# EAGLE design power_12v_5v_non_regulated (EAGLE 9.3.0)
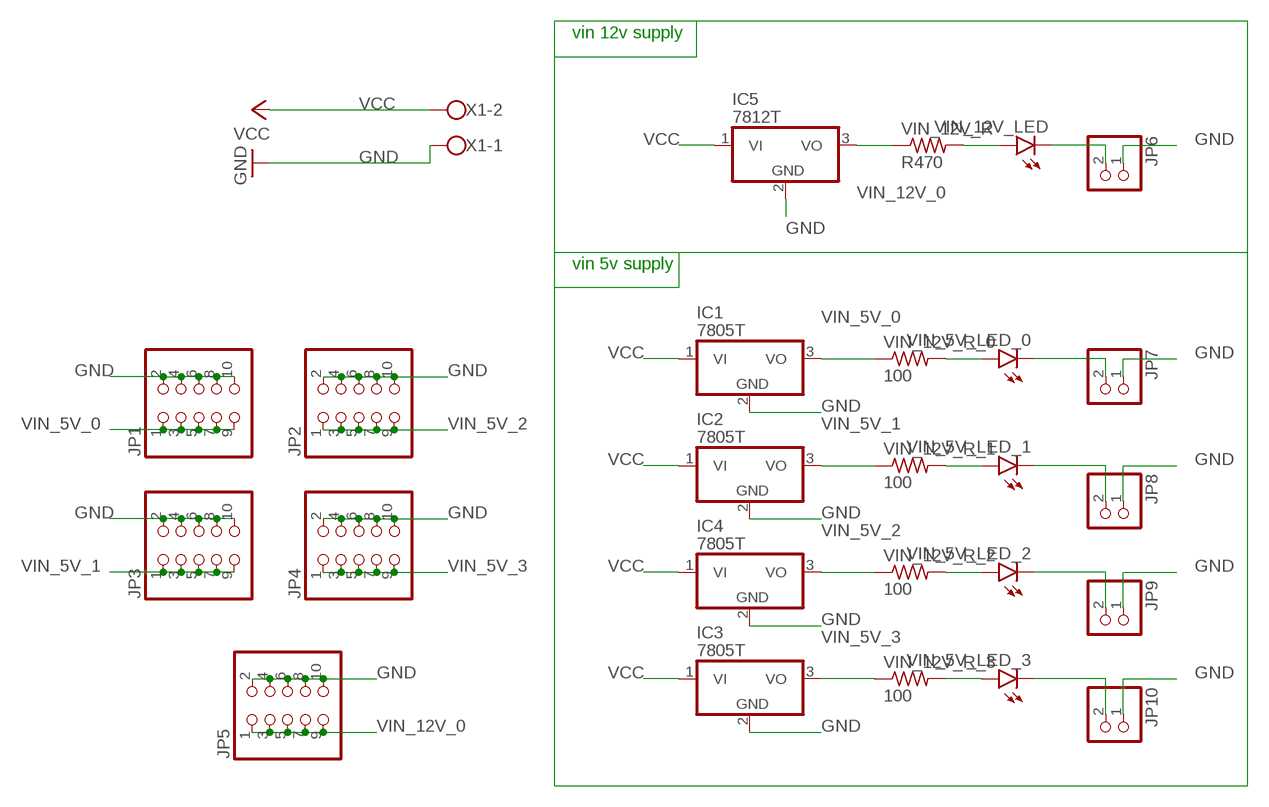
[diagram p0: schematic, sheet 1]

## Parts
IC1  7805T  [TO220H]
IC2  7805T  [TO220H]
IC3  7805T  [TO220H]
IC4  7805T  [TO220H]
IC5  7812T  [TO220H]
JP1  PINHD-2X5  [2X05]
JP2  PINHD-2X5  [2X05]
JP3  PINHD-2X5  [2X05]
JP4  PINHD-2X5  [2X05]
JP5  PINHD-2X5  [2X05]
JP6  PINHD-1X2  [1X02]
JP7  PINHD-1X2  [1X02]
JP8  PINHD-1X2  [1X02]
JP9  PINHD-1X2  [1X02]
JP10  PINHD-1X2  [1X02]
VIN_5V_LED_0  LEDSMT1206  [1206]
VIN_5V_LED_1  LEDSMT1206  [1206]
VIN_5V_LED_2  LEDSMT1206  [1206]
VIN_5V_LED_3  LEDSMT1206  [1206]
VIN_12V_LED  LEDSMT1206  [1206]
VIN_12V_R  R470  R-US_R0805  [R0805]
VIN_12V_R_0  100  R-US_R0805  [R0805]
VIN_12V_R_1  100  R-US_R0805  [R0805]
VIN_12V_R_2  100  R-US_R0805  [R0805]
VIN_12V_R_3  100  R-US_R0805  [R0805]
X1  W237-102  [W237-102]

## Nets
GND: IC1.2(GND) IC2.2(GND) IC3.2(GND) IC4.2(GND) IC5.2(GND) JP1.2 JP1.4 JP1.6 JP1.8 JP1.10 JP2.2 JP2.4 JP2.6 JP2.8 JP2.10 JP3.2 JP3.4 JP3.6 JP3.8 JP3.10 JP4.2 JP4.4 JP4.6 JP4.8 JP4.10 JP5.2 JP5.4 JP5.6 JP5.8 JP5.10 JP6.1 JP7.1 JP8.1 JP9.1 JP10.1 X1.1
N$2: VIN_12V_LED.A VIN_12V_R.2
N$4: VIN_5V_LED_0.A VIN_12V_R_0.2
N$6: VIN_5V_LED_1.A VIN_12V_R_1.2
N$8: VIN_5V_LED_2.A VIN_12V_R_2.2
N$10: VIN_5V_LED_3.A VIN_12V_R_3.2
N$19: JP7.2 VIN_5V_LED_0.C
N$20: JP6.2 VIN_12V_LED.C
N$21: JP8.2 VIN_5V_LED_1.C
N$22: JP9.2 VIN_5V_LED_2.C
N$23: JP10.2 VIN_5V_LED_3.C
VCC: IC1.1(VI) IC2.1(VI) IC3.1(VI) IC4.1(VI) IC5.1(VI) X1.2
VIN_5V_0: IC1.3(VO) JP1.1 JP1.3 JP1.5 JP1.7 JP1.9 VIN_12V_R_0.1
VIN_5V_1: IC2.3(VO) JP3.1 JP3.3 JP3.5 JP3.7 JP3.9 VIN_12V_R_1.1
VIN_5V_2: IC4.3(VO) JP2.1 JP2.3 JP2.5 JP2.7 JP2.9 VIN_12V_R_2.1
VIN_5V_3: IC3.3(VO) JP4.1 JP4.3 JP4.5 JP4.7 JP4.9 VIN_12V_R_3.1
VIN_12V_0: IC5.3(VO) JP5.1 JP5.3 JP5.5 JP5.7 JP5.9 VIN_12V_R.1

## Notes on the sheet
- vin 12v supply
- vin 5v supply

## Library data of the parts
IC1-IC5 = linear:78*: Positive VOLTAGE REGULATOR Source: http://cache.national.com/ds/LM/LM78L05.pdf http://www.fairchildsemi.com/ds/LM/LM7805.pdf
JP1-JP5 = pinhead:PINHD-2X5: PIN HEADER
JP6-JP10 = pinhead:PINHD-1X2: PIN HEADER
VIN_5V_LED_0 VIN_5V_LED_1-VIN_5V_LED_3 VIN_12V_LED = led:LED: LED OSRAM: - CHIPLED LG R971, LG N971, LY N971, LG Q971, LY Q971, LO R971, LY R971 LH N974, LH R974 LS Q976, LO Q976, LY Q976 LO Q996 - Hyper CHIPLED LW Q18S LB Q993, LB Q99A, LB R99A - SideLED LS A670, LO A670, LY A670, LG A670, LP A670 LB A673, LV A673, LT A673, LW A673 LH A674 LY A675 LS A676, LA A676, LO A676, LY A676, LW A676 LS A679, LY A679, LG A679 - Hyper Micro SIDELED® LS Y876, LA Y876, LO Y876, LY Y876 LT Y87S - SmartLED LW L88C, LW L88S LB L89C, LB L89S, LG L890 LS L89K, LO L89K, LY L89K LS L896, LA L896, LO L896, LY L896 - TOPLED LS T670, LO T670, LY T670, LG T670, LP T670 LSG T670, LSP T670, LSY T670, LOP T670, LYG T670 LG T671, LOG T671, LSG T671 LB T673, LV T673, LT T673, LW T673 LH T674 LS T676, LA T676, LO T676, LY T676, LB T676, LH T676, LSB T676, LW T676 LB T67C, LV T67C, LT T67C, LS T67K, LO T67K, LY T67K, LW E67C LS E67B, LA E67B, LO E67B, LY E67B, LB E67C, LV E67C, LT E67C LW T67C LS T679, LY T679, LG T679 LS T770, LO T770, LY T770, LG T770, LP T770 LB T773, LV T773, LT T773, LW T773 LH T774 LS E675, LA E675, LY E675, LS T675 LS T776, LA T776, LO T776, LY T776, LB T776 LHGB T686 LT T68C, LB T68C - Hyper Mini TOPLED® LB M676 - Mini TOPLED Santana® LG M470 LS M47K, LO M47K, LY M47K Source: http://www.osram.convergy.de LUXEON: - LUMILED® LXK2-PW12-R00, LXK2-PW12-S00, LXK2-PW14-U00, LXK2-PW14-V00 LXK2-PM12-R00, LXK2-PM12-S00, LXK2-PM14-U00 LXK2-PE12-Q00, LXK2-PE12-R00, LXK2-PE12-S00, LXK2-PE14-T00, LXK2-PE14-U00 LXK2-PB12-K00, LXK2-PB12-L00, LXK2-PB12-M00, LXK2-PB14-N00, LXK2-PB14-P00, LXK2-PB14-Q00 LXK2-PR12-L00, LXK2-PR12-M00, LXK2-PR14-Q00, LXK2-PR14-R00 LXK2-PD12-Q00, LXK2-PD12-R00, LXK2-PD12-S00 LXK2-PH12-R00, LXK2-PH12-S00 LXK2-PL12-P00, LXK2-PL12-Q00, LXK2-PL12-R00 Source: www.luxeon.com KINGBRIGHT: KA-3528ASYC Source: www.kingbright.com
VIN_12V_R VIN_12V_R_0 VIN_12V_R_1-VIN_12V_R_3 = rcl:R-US_: RESISTOR, American symbol; SPICEPREFIX: R
X1 = con-wago-500:W237-102: WAGO SCREW CLAMP; MPN: 237-102; OC_FARNELL: unknown; OC_NEWARK: 70K9898

## Board
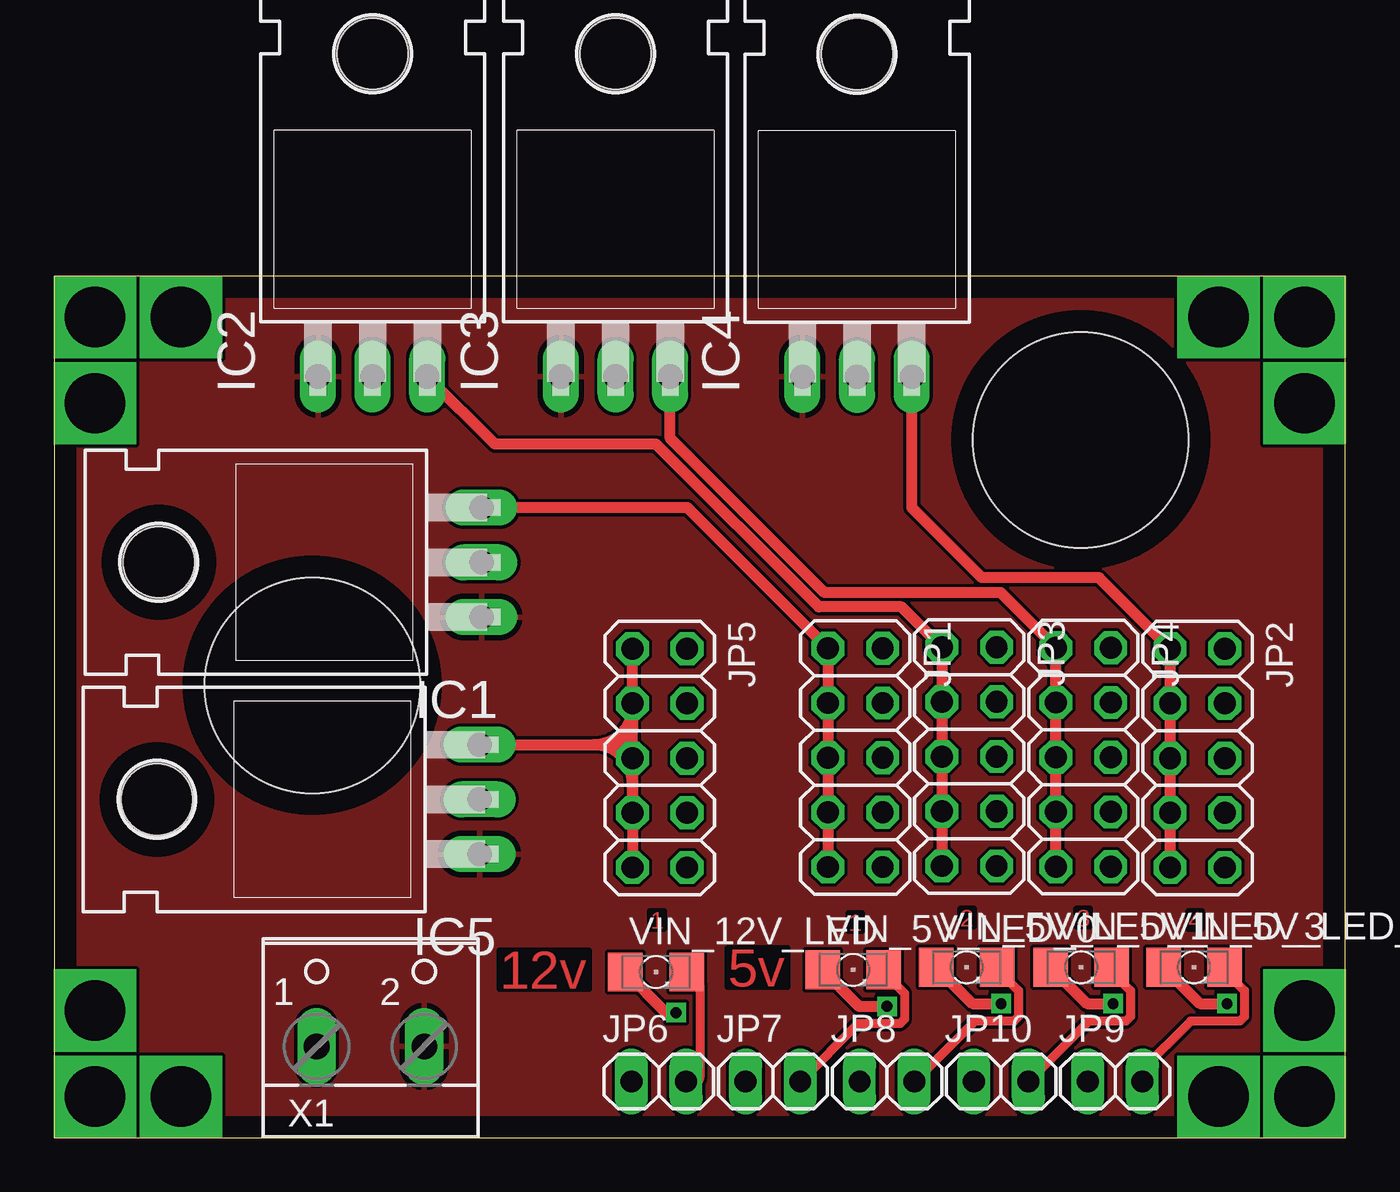
[diagram p1: board, top side]
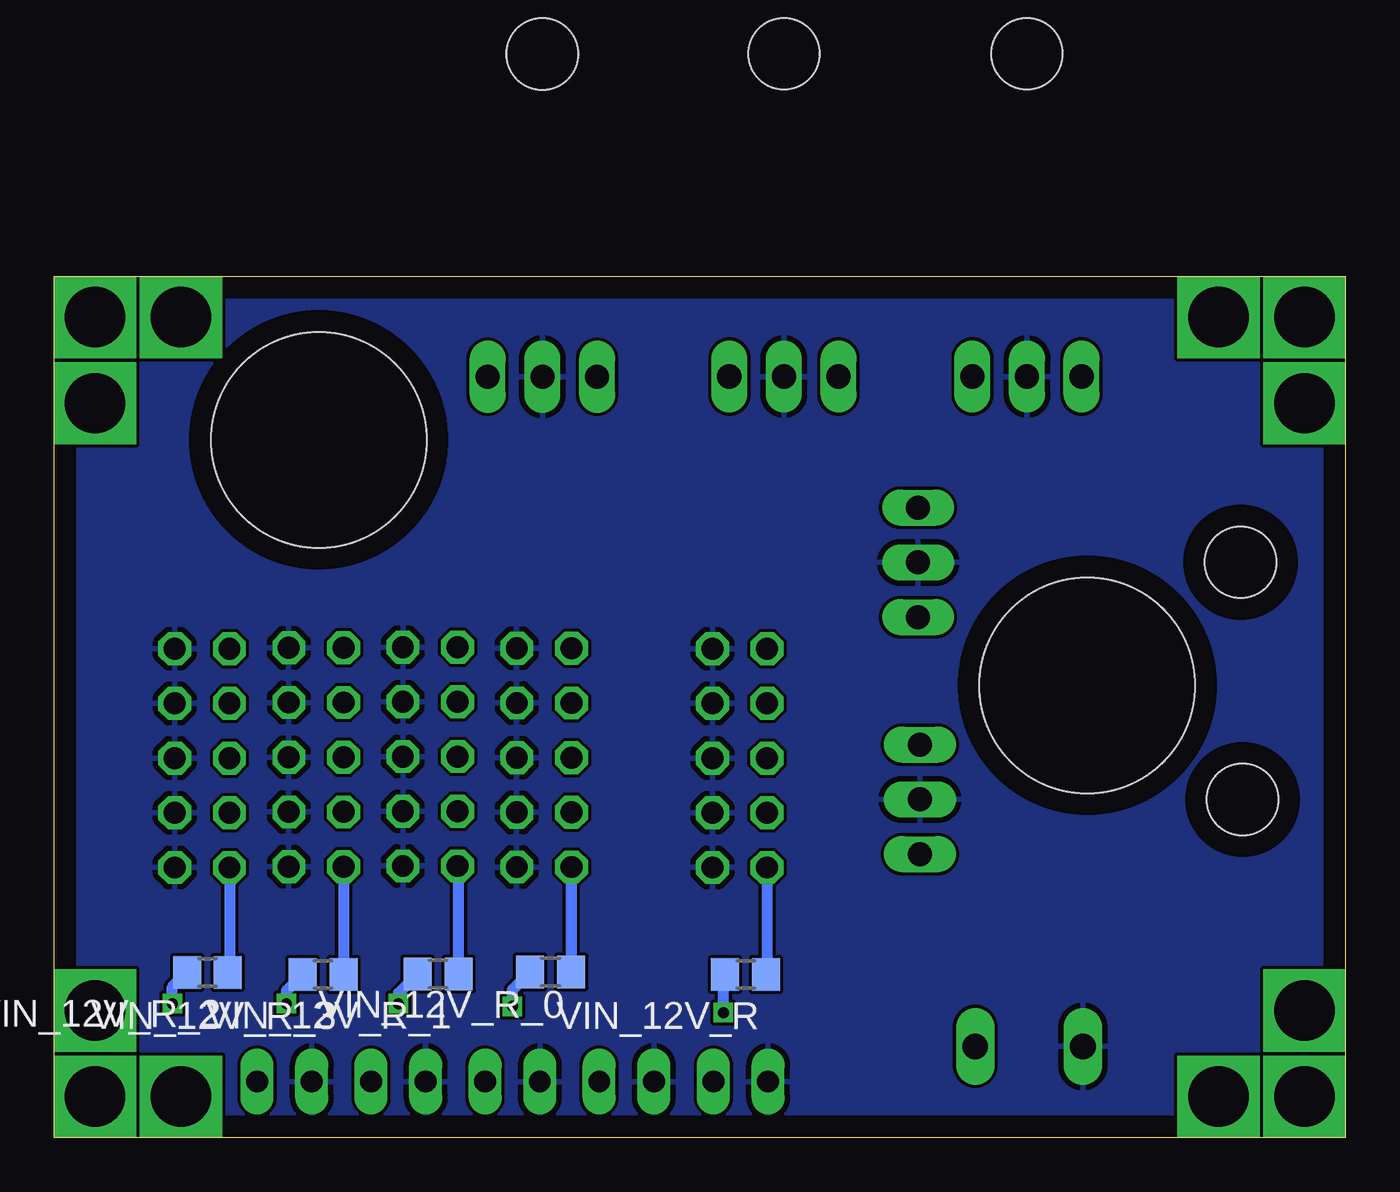
[diagram p2: board, bottom side, seen from below]

Size 60 x 40 mm. Coordinates in mm from the lower left corner, seen from the top.
Outline: 0,0 60,0 60,40 0,40 0,0
Copper layers (1*16): Top 0.035mm / dielectric 1.5mm / Bottom 0.035mm
Design rules "default *": minimum track width 1mil, minimum drill 0.35mm, track to track 6mil, track to pad 6mil, pad to pad 6mil, via to via 6mil, smd to smd 6mil, copper to edge 40mil, drill to drill 6mil, minimum pad ring 10mil, minimum via ring 8mil, stop-mask expansion 4mil, vias tented up to drill 0mil, thermal gap 10mil
Holes 10 mm at 47.7,32.4 12,21

### Footprints (pad centres in the part's own frame; a part is rotated, then mirrored left to right if it is on the bottom)
TO220H = drill 1.118 long: 1 -2.54,-10.16; 2 0,-10.16; 3 2.54,-10.16 | hole 3.302: 0,4.826
2X05 = drill 1.016 octagon: 1 -5.08,-1.27; 2 -5.08,1.27; 3 -2.54,-1.27; 4 -2.54,1.27; 5 0,-1.27; 6 0,1.27; 7 2.54,-1.27; 8 2.54,1.27; 9 5.08,-1.27; 10 5.08,1.27
1X02 = drill 1.016 long: 1 -1.27,0; 2 1.27,0
1206 = smd 1.6 x 1.803: A -1.422,0; C 1.422,0
R0805 = smd 1.3 x 1.5: 1 -0.95,0; 2 0.95,0
W237-102 = drill 1.194 long: 1 -2.5,-1.27; 2 2.5,-1.27

### Placement (x,y rotation side)
IC1  9.7,26.71 90 top
IC2  14.8,45.5 0 top
IC3  26.09,45.5 0 top
IC4  37.31,45.49 0 top
IC5  9.61,15.7 90 top
JP1  37.23,17.64 270 top
JP2  53.12,17.62 270 top
JP3  42.52,17.69 270 top
JP4  47.82,17.66 270 top
JP5  28.14,17.62 270 top
JP6  28.1,2.6 0 top
JP7  33.4,2.6 0 top
JP8  38.7,2.6 0 top
JP9  49.3,2.6 0 top
JP10  44,2.6 0 top
VIN_5V_LED_0  37.13,7.79 0 top
VIN_5V_LED_1  42.4,7.91 0 top
VIN_5V_LED_2  52.96,7.91 0 top
VIN_5V_LED_3  47.72,7.91 0 top
VIN_12V_LED  27.97,7.69 0 top
VIN_12V_R  27.87,7.57 180 bottom
VIN_12V_R_0  36.93,7.69 180 bottom
VIN_12V_R_1  42.16,7.59 180 bottom
VIN_12V_R_2  52.87,7.67 180 bottom
VIN_12V_R_3  47.5,7.57 180 bottom
X1  14.7,5.5 0 top

### Tracks (layer width: path | path; a pad name or v marks a point on that pad's centre or on a via)
GND
  pour Bottom: 0,0 60,0 60,40 0,40
N$1  (via drill 2.8)
  other vias: 58.1,38.1
N$2  (via drill 0.5)
  Top 0.508: VIN_12V_LED.A 28.44,5.79 v28.9,5.79
  Bottom 0.508: v28.9,5.79 28.9,7.49 VIN_12V_R.2
N$3  (via drill 2.8)
  other vias: 58.1,1.9
N$4  (via drill 0.5)
  Top 0.508: VIN_5V_LED_0.A 37.4,6.09 v38.7,6.09
  Bottom 0.508: v38.7,6.09 38.7,6.87 VIN_12V_R_0.2
N$5  (via drill 2.8)
  other vias: 1.9,1.9
N$6  (via drill 0.5)
  Top 0.508: VIN_5V_LED_1.A 42.67,6.21 v44,6.21
  Bottom 0.508: v44,6.21 44,6.7 VIN_12V_R_1.2
N$7  (via drill 2.8)
  other vias: 1.9,38.1
N$8  (via drill 0.5)
  Top 0.508: VIN_5V_LED_2.A 53.23,6.21 v54.5,6.21
  Bottom 0.508: v54.5,6.21 54.5,6.99 VIN_12V_R_2.2
N$9  (via drill 2.8)
  other vias: 1.9,34.1
N$10  (via drill 0.5)
  Top 0.508: VIN_5V_LED_3.A 47.99,6.21 v49.2,6.21
  Bottom 0.508: v49.2,6.21 49.2,6.82 VIN_12V_R_3.2
N$12  (via drill 2.8)
  other vias: 5.9,38.1
N$13  (via drill 2.8)
  other vias: 54.1,38.1
N$14  (via drill 2.8)
  other vias: 58.1,34.1
N$15  (via drill 2.8)
  other vias: 58.1,5.9
N$16  (via drill 2.8)
  other vias: 54.1,1.9
N$17  (via drill 2.8)
  other vias: 5.9,1.9
N$18  (via drill 2.8)
  other vias: 1.9,5.9
N$19
  Top 0.406: VIN_5V_LED_0.C 38.55,7.65 39.51,6.7 39.51,5.5 39.3,5.29 37.36,5.29 JP7.2
N$20
  Top 0.406: JP6.2 29.8,2.6 arc90 30,2.8 30,7.08 VIN_12V_LED.C
N$21
  Top 0.406: VIN_5V_LED_1.C 43.82,7.8 44.81,6.82 44.81,5.62 44.6,5.41 42.78,5.41 JP8.2
N$22
  Top 0.406: VIN_5V_LED_2.C 54.38,7.74 55.31,6.82 55.31,5.62 55.1,5.41 52.81,5.41 50.5,3.1 50.57,3.03 JP9.2
N$23
  Top 0.406: VIN_5V_LED_3.C 49.14,7.68 50.01,6.82 50.01,5.62 49.8,5.41 48.08,5.41 JP10.2
VCC
  pour Top: 0,0 60,0 60,40 0,40
VIN_5V_0
  Top 0.508: JP1.9 JP1.7 JP1.5 JP1.3 JP1.1 29.43,29.25 IC1.3
  Bottom 0.508: JP1.9 35.98,12.54 VIN_12V_R_0.1
VIN_5V_1
  Top 0.508: JP3.9 JP3.7 JP3.5 JP3.3 JP3.1 39.38,24.64 35.53,24.64 27.97,32.2 20.48,32.2 IC2.3
  Bottom 0.508: VIN_12V_R_1.1 41.21,12.57 JP3.9
VIN_5V_2
  Top 0.508: JP2.9 JP2.7 JP2.5 JP2.3 JP2.1 48.55,26 43.1,26 39.85,29.25 IC4.3
  Bottom 0.508: JP2.9 51.85,7.74 VIN_12V_R_2.1
VIN_5V_3
  Top 0.508: JP4.9 JP4.7 JP4.5 JP4.3 JP4.1 43.99,25.3 35.8,25.3 28.63,32.47 IC3.3
  Bottom 0.508: JP4.9 VIN_12V_R_3.1
VIN_12V_0
  Top 0.508: IC5.3 25.1,18.24 | 25.1,18.24 25.9,18.24 | 25.9,18.24 26.1,18.24 | 26.1,18.24 26.87,18.24 JP5.5 | JP5.5 JP5.3 | JP5.3 JP5.1 | JP5.5 JP5.7 | JP5.7 JP5.9 | JP5.7 26.87,17.27 arc90 25.9,18.24 | JP5.3 26.87,19.01 arc-90 26.1,18.24 | JP5.3 26.87,20.01 arc-90 25.1,18.24 | JP5.7 26.87,16.47 arc90 25.1,18.24
  Bottom 0.508: JP5.9 26.87,7.62 VIN_12V_R.1

### Text on the board
Top: 1 | 1 | 2 | 3 | 4 | 12v | 5v